# Altium schematic sheet Submarine.SchDoc
size E
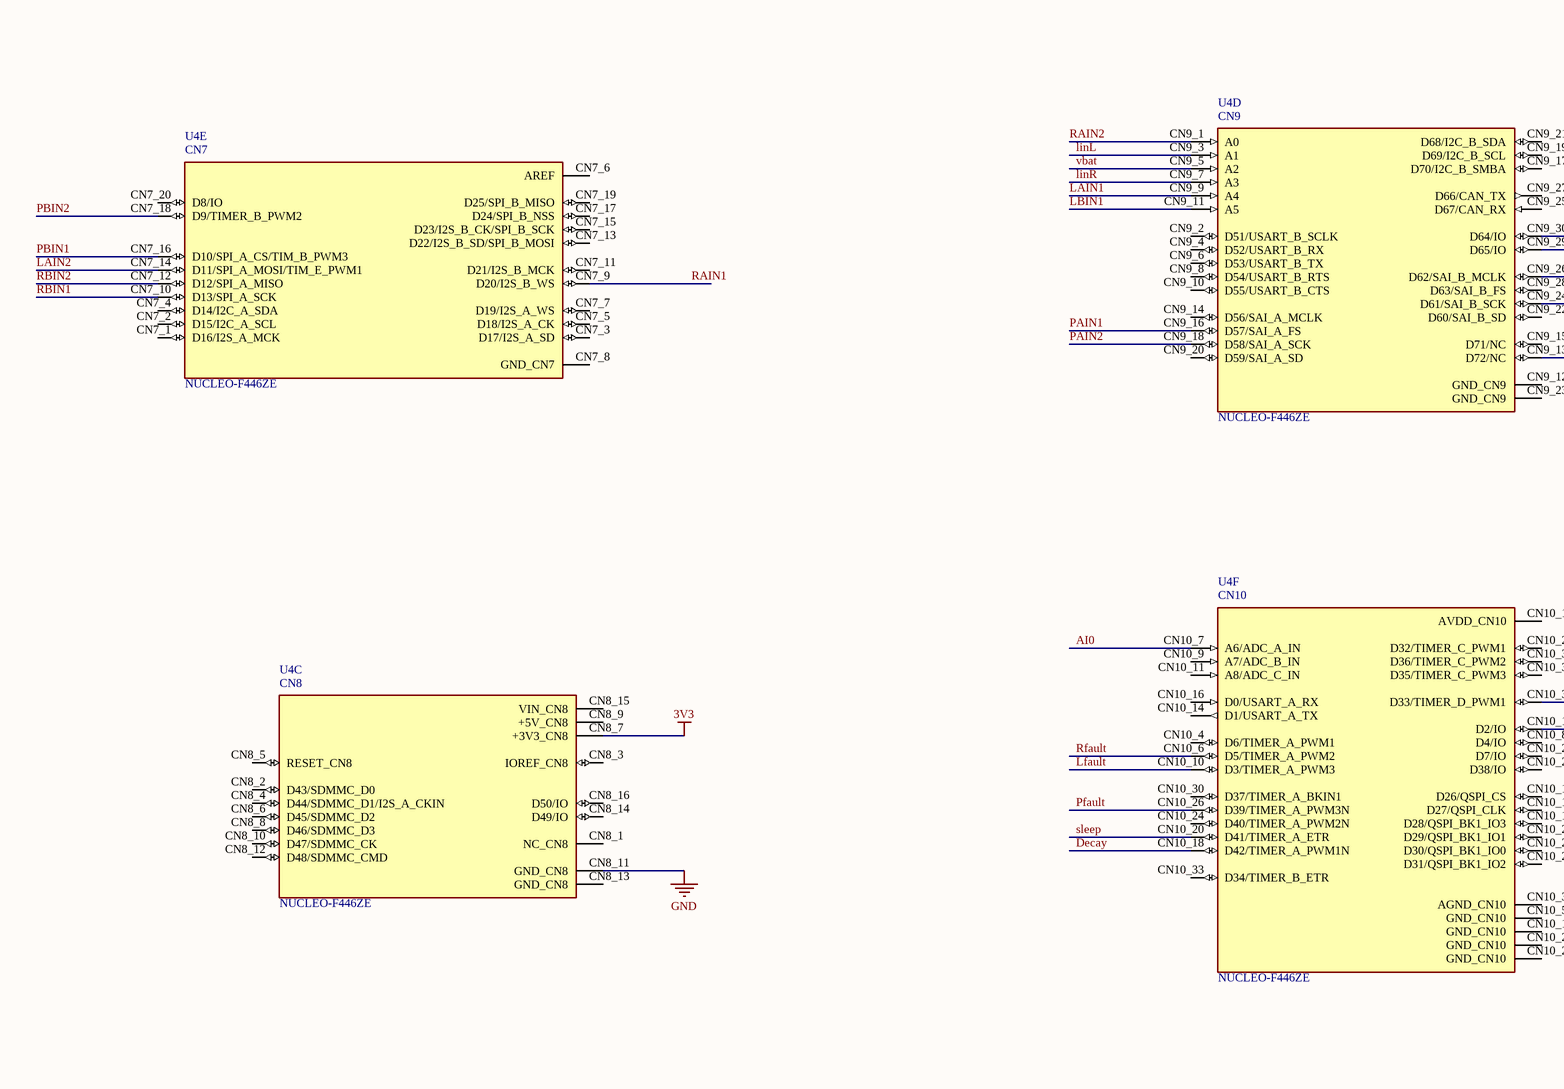
[diagram p0: Submarine.SchDoc, top left]
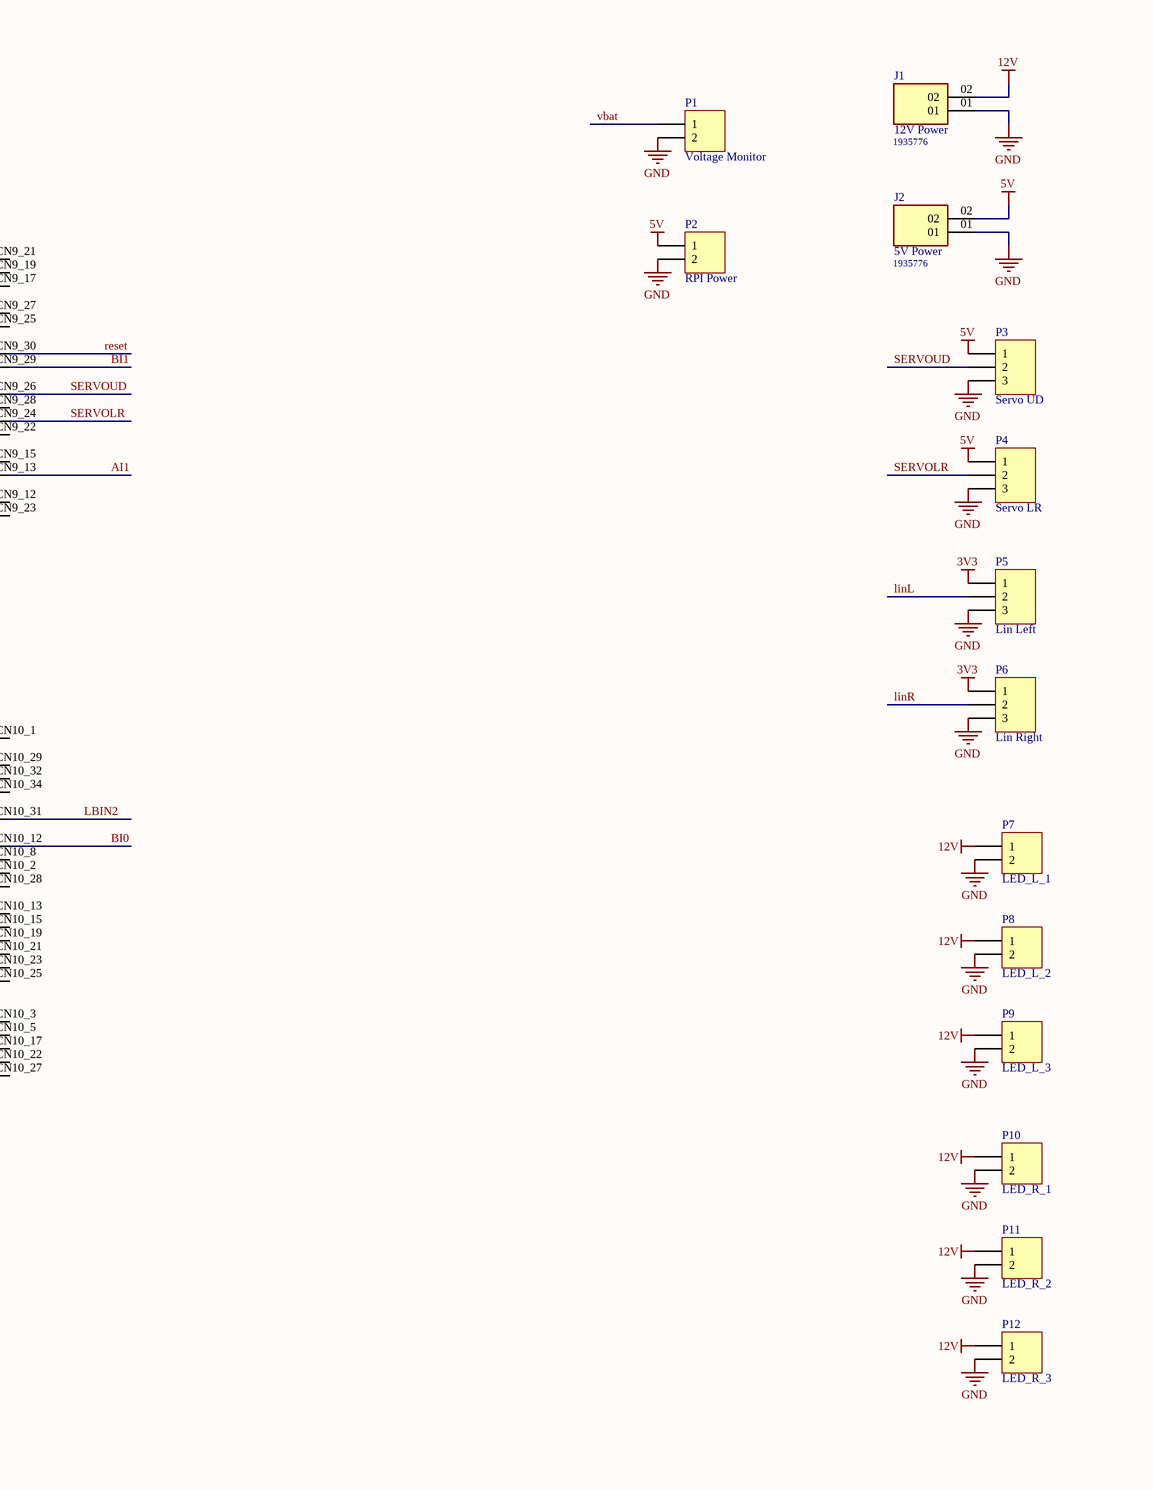
[diagram p1: Submarine.SchDoc, top middle]
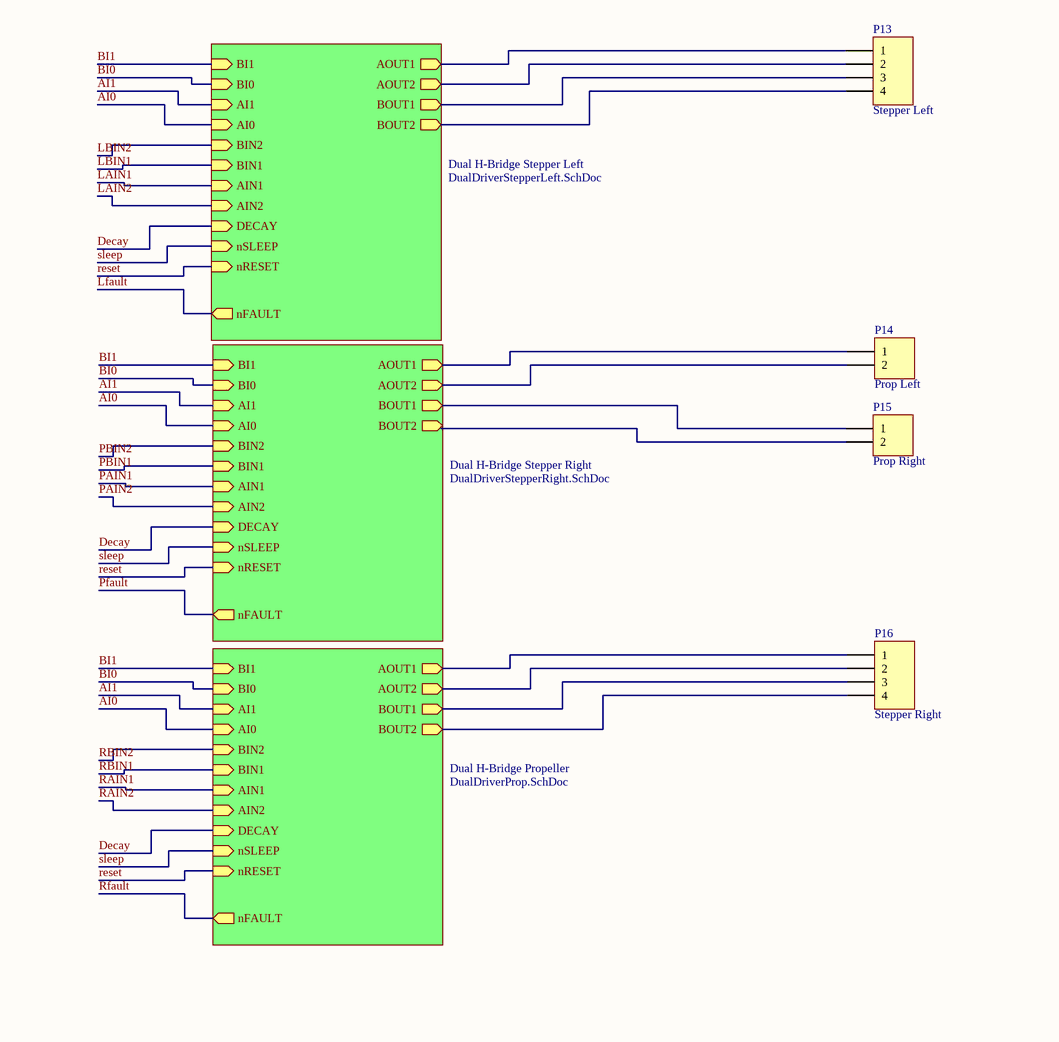
[diagram p2: Submarine.SchDoc, bottom middle]
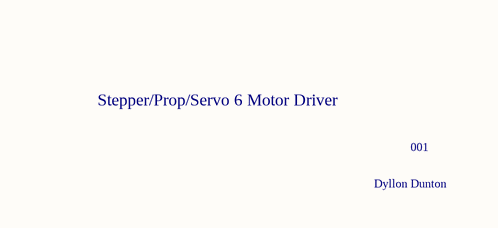
[diagram p3: Submarine.SchDoc, bottom right]

## Parts
J1  12V Power  [PHOENIX_1935776]
J2  5V Power  [PHOENIX_1935776]
P1  Voltage Monitor  [HDR1X2]
P2  RPI Power  [HDR1X2]
P3  Servo UD  [HDR1X3]
P4  Servo LR  [HDR1X3]
P5  Lin Left  [HDR1X3]
P6  Lin Right  [HDR1X3]
P7  LED_L_1  [HDR1X2]
P8  LED_L_2  [HDR1X2]
P9  LED_L_3  [HDR1X2]
P10  LED_R_1  [HDR1X2]
P11  LED_R_2  [HDR1X2]
P12  LED_R_3  [HDR1X2]
P13  Stepper Left  [HDR1X4]
P14  Prop Left  [HDR1X2]
P15  Prop Right  [HDR1X2]
P16  Stepper Right  [HDR1X4]
U4  NUCLEO-F446ZE  [MODULE_NUCLEO-F446ZE]  (parts C,D,E,F of 6)

## Sub-sheets
Dual H-Bridge Propeller = DualDriverProp.SchDoc: BI1 (in), BI0 (in), AI1 (in), AI0 (in), BIN2 (in), BIN1 (in), AIN1 (in), AIN2 (in), DECAY (in), nSLEEP (in), nRESET (in), nFAULT (out), AOUT1 (out), AOUT2 (out), BOUT1 (out), BOUT2 (out)
Dual H-Bridge Stepper Left = DualDriverStepperLeft.SchDoc: BI1 (in), BI0 (in), AI1 (in), AI0 (in), BIN2 (in), BIN1 (in), AIN1 (in), AIN2 (in), DECAY (in), nSLEEP (in), nRESET (in), nFAULT (out), AOUT1 (out), AOUT2 (out), BOUT1 (out), BOUT2 (out)
Dual H-Bridge Stepper Right = DualDriverStepperRight.SchDoc: BI1 (in), BI0 (in), AI1 (in), AI0 (in), BIN2 (in), BIN1 (in), AIN1 (in), AIN2 (in), DECAY (in), nSLEEP (in), nRESET (in), nFAULT (out), AOUT1 (out), AOUT2 (out), BOUT1 (out), BOUT2 (out)

## Nets
3V3: P5.1 P6.1 U4.CN8_7(+3V3_CN8)
5V: J2.02 P2.1 P3.1 P4.1
12V: J1.02 P7.1 P8.1 P9.1 P10.1 P11.1 P12.1
GND: J1.01 J2.01 P1.2 P2.2 P3.3 P4.3 P5.3 P6.3 P7.2 P8.2 P9.2 P10.2 P11.2 P12.2 U4.CN8_11(GND_CN8)
AI0: U4.CN10_7(A6/ADC_A_IN) ; sheet Dual H-Bridge Stepper Left/AI0, sheet Dual H-Bridge Stepper Right/AI0, sheet Dual H-Bridge Propeller/AI0
AI1: U4.CN9_13(D72/NC) ; sheet Dual H-Bridge Stepper Left/AI1, sheet Dual H-Bridge Stepper Right/AI1, sheet Dual H-Bridge Propeller/AI1
BI0: U4.CN10_12(D2/IO) ; sheet Dual H-Bridge Stepper Left/BI0, sheet Dual H-Bridge Stepper Right/BI0, sheet Dual H-Bridge Propeller/BI0
BI1: U4.CN9_29(D65/IO) ; sheet Dual H-Bridge Stepper Left/BI1, sheet Dual H-Bridge Stepper Right/BI1, sheet Dual H-Bridge Propeller/BI1
Decay: U4.CN10_18(D42/TIMER_A_PWM1N) ; sheet Dual H-Bridge Stepper Left/DECAY, sheet Dual H-Bridge Stepper Right/DECAY, sheet Dual H-Bridge Propeller/DECAY
LAIN1: U4.CN9_9(A4) ; sheet Dual H-Bridge Stepper Left/AIN1
LAIN2: U4.CN7_14(D11/SPI_A_MOSI/TIM_E_PWM1) ; sheet Dual H-Bridge Stepper Left/AIN2
LBIN1: U4.CN9_11(A5) ; sheet Dual H-Bridge Stepper Left/BIN1
LBIN2: U4.CN10_31(D33/TIMER_D_PWM1) ; sheet Dual H-Bridge Stepper Left/BIN2
Lfault: U4.CN10_10(D3/TIMER_A_PWM3) ; sheet Dual H-Bridge Stepper Left/nFAULT
linL: P5.2 U4.CN9_3(A1)
linR: P6.2 U4.CN9_7(A3)
PAIN1: U4.CN9_16(D57/SAI_A_FS) ; sheet Dual H-Bridge Stepper Right/AIN1
PAIN2: U4.CN9_18(D58/SAI_A_SCK) ; sheet Dual H-Bridge Stepper Right/AIN2
PBIN1: U4.CN7_16(D10/SPI_A_CS/TIM_B_PWM3) ; sheet Dual H-Bridge Stepper Right/BIN1
PBIN2: U4.CN7_18(D9/TIMER_B_PWM2) ; sheet Dual H-Bridge Stepper Right/BIN2
Pfault: U4.CN10_26(D39/TIMER_A_PWM3N) ; sheet Dual H-Bridge Stepper Right/nFAULT
RAIN1: U4.CN7_9(D20/I2S_B_WS) ; sheet Dual H-Bridge Propeller/AIN1
RAIN2: U4.CN9_1(A0) ; sheet Dual H-Bridge Propeller/AIN2
RBIN1: U4.CN7_10(D13/SPI_A_SCK) ; sheet Dual H-Bridge Propeller/BIN1
RBIN2: U4.CN7_12(D12/SPI_A_MISO) ; sheet Dual H-Bridge Propeller/BIN2
reset: U4.CN9_30(D64/IO) ; sheet Dual H-Bridge Stepper Left/nRESET, sheet Dual H-Bridge Stepper Right/nRESET, sheet Dual H-Bridge Propeller/nRESET
Rfault: U4.CN10_6(D5/TIMER_A_PWM2) ; sheet Dual H-Bridge Propeller/nFAULT
SERVOLR: P4.2 U4.CN9_24(D61/SAI_B_SCK)
SERVOUD: P3.2 U4.CN9_26(D62/SAI_B_MCLK)
sleep: U4.CN10_20(D41/TIMER_A_ETR) ; sheet Dual H-Bridge Stepper Left/nSLEEP, sheet Dual H-Bridge Stepper Right/nSLEEP, sheet Dual H-Bridge Propeller/nSLEEP
vbat: P1.1 U4.CN9_5(A2)
NetP13_1: P13.1 ; sheet Dual H-Bridge Stepper Left/AOUT1
NetP13_2: P13.2 ; sheet Dual H-Bridge Stepper Left/AOUT2
NetP13_3: P13.3 ; sheet Dual H-Bridge Stepper Left/BOUT1
NetP13_4: P13.4 ; sheet Dual H-Bridge Stepper Left/BOUT2
NetP14_1: P14.1 ; sheet Dual H-Bridge Stepper Right/AOUT1
NetP14_2: P14.2 ; sheet Dual H-Bridge Stepper Right/AOUT2
NetP15_1: P15.1 ; sheet Dual H-Bridge Stepper Right/BOUT1
NetP16_1: P16.1 ; sheet Dual H-Bridge Propeller/AOUT1
NetP16_2: P16.2 ; sheet Dual H-Bridge Propeller/AOUT2
NetP16_3: P16.3 ; sheet Dual H-Bridge Propeller/BOUT1
NetP16_4: P16.4 ; sheet Dual H-Bridge Propeller/BOUT2

Not connected (* = marked no-connect by the designer): P15 2; U4 CN7_1(D16/I2S_A_MCK) CN7_2(D15/I2C_A_SCL) CN7_3(D17/I2S_A_SD) CN7_4(D14/I2C_A_SDA) CN7_5(D18/I2S_A_CK) CN7_6(AREF) CN7_7(D19/I2S_A_WS) CN7_8(GND_CN7) CN7_11(D21/I2S_B_MCK) CN7_13(D22/I2S_B_SD/SPI_B_MOSI) CN7_15(D23/I2S_B_CK/SPI_B_SCK) CN7_17(D24/SPI_B_NSS) CN7_19(D25/SPI_B_MISO) CN7_20(D8/IO) CN8_1(NC_CN8) CN8_2(D43/SDMMC_D0) CN8_3(IOREF_CN8) CN8_4(D44/SDMMC_D1/I2S_A_CKIN) CN8_5(RESET_CN8) CN8_6(D45/SDMMC_D2) CN8_8(D46/SDMMC_D3) CN8_9(+5V_CN8) CN8_10(D47/SDMMC_CK) CN8_12(D48/SDMMC_CMD) CN8_13(GND_CN8) CN8_14(D49/IO) CN8_15(VIN_CN8) CN8_16(D50/IO) CN9_2(D51/USART_B_SCLK) CN9_4(D52/USART_B_RX) CN9_6(D53/USART_B_TX) CN9_8(D54/USART_B_RTS) CN9_10(D55/USART_B_CTS) CN9_12(GND_CN9) CN9_14(D56/SAI_A_MCLK) CN9_15(D71/NC) CN9_17(D70/I2C_B_SMBA) CN9_19(D69/I2C_B_SCL) CN9_20(D59/SAI_A_SD) CN9_21(D68/I2C_B_SDA) CN9_22(D60/SAI_B_SD) CN9_23(GND_CN9) CN9_25(D67/CAN_RX) CN9_27(D66/CAN_TX) CN9_28(D63/SAI_B_FS) CN10_1(AVDD_CN10) CN10_2(D7/IO) CN10_3(AGND_CN10) CN10_4(D6/TIMER_A_PWM1) CN10_5(GND_CN10) CN10_8(D4/IO) CN10_9(A7/ADC_B_IN) CN10_11(A8/ADC_C_IN) CN10_13(D26/QSPI_CS) CN10_14(D1/USART_A_TX) CN10_15(D27/QSPI_CLK) CN10_16(D0/USART_A_RX) CN10_17(GND_CN10) CN10_19(D28/QSPI_BK1_IO3) CN10_21(D29/QSPI_BK1_IO1) CN10_22(GND_CN10) CN10_23(D30/QSPI_BK1_IO0) CN10_24(D40/TIMER_A_PWM2N) CN10_25(D31/QSPI_BK1_IO2) CN10_27(GND_CN10) CN10_28(D38/IO) CN10_29(D32/TIMER_C_PWM1) CN10_30(D37/TIMER_A_BKIN1) CN10_32(D36/TIMER_C_PWM2) CN10_33(D34/TIMER_B_ETR) CN10_34(D35/TIMER_C_PWM3)

## Notes on the sheet
- (near J1) 1935776
- (near J2) 1935776
- Stepper/Prop/Servo 6 Motor Driver
- Dyllon Dunton
- 001
- (in symbol NUCLEO-F446ZE, part C) CN8
- (in symbol NUCLEO-F446ZE, part D) CN9
- (in symbol NUCLEO-F446ZE, part E) CN7
- (in symbol NUCLEO-F446ZE, part F) CN10

## Library data of the parts
J1 J2 = 1935776: Package: None; MP: 1935776; Availability: Unavailable; Price: None; Value: *
P1 P2 P7-P12 P14 P15 = Header 2: Header, 2-Pin; LatestRevisionDate: 17-Jul-2002; LatestRevisionNote: Re-released for DXP Platform.; Publisher: Altium Limited
P3-P6 = Header 3: Header, 3-Pin; LatestRevisionDate: 17-Jul-2002; LatestRevisionNote: Re-released for DXP Platform.; Publisher: Altium Limited
P13 P16 = Header 4: Header, 4-Pin; LatestRevisionDate: 17-Jul-2002; LatestRevisionNote: Re-released for DXP Platform.; Publisher: Altium Limited
U4 = NUCLEO-F446ZE: STM32F446ZE, mbed-Enabled Development Nucleo-144 STM32F4 ARMÂ® CortexÂ®-M4 MCU 32-Bit Embedded Evaluation Board; MF: STMicroelectronics; MP: NUCLEO-F446ZE; Value: *; Check_prices: https://www.snapeda.com/parts/NUCLEO-F446ZE/STMicroelectronics/view-part/?ref=eda; Package: None; Price: None; Availability: In Stock; Purchase-URL: https://pricing.snapeda.com/search/part/NUCLEO-F446ZE/?ref=eda; SnapEDA_Link: https://www.snapeda.com/parts/NUCLEO-F446ZE/STMicroelectronics/view-part/?ref=snap